# EAGLE design MgdOpl3 (EAGLE 9.5.0)
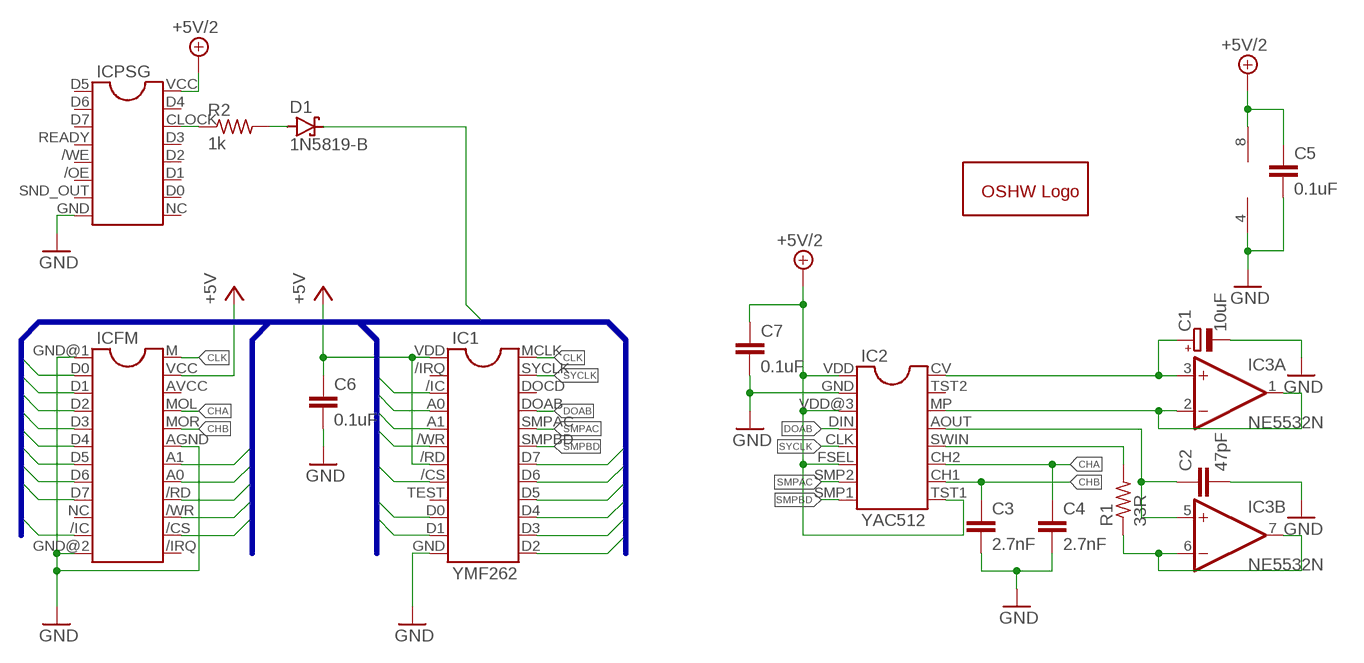
[diagram p0: schematic, sheet 1]

## Parts
C1  10uF  CPOL-EUE2.5-5  [E2,5-5]
C2  47pF  C-EU025-024X044  [C025-024X044]
C3  2.7nF  C-EU025-024X044  [C025-024X044]
C4  2.7nF  C-EU025-024X044  [C025-024X044]
C5  0.1uF  C-EU025-024X044  [C025-024X044]
C6  0.1uF  C-EU025-024X044  [C025-024X044]
C7  0.1uF  C-EU025-024X044  [C025-024X044]
D1  1N5819-B  [DO41-7.6]
GOLD_ORB_SM2  OSHWLOGOLOGO8MM  [OSHW_8MM]
IC1  YMF262  [YMF262]
IC2  YAC512  [YAC512]
IC3  NE5532N  [DIL08]
ICFM  YM2612YM2612_NOSILK  [YM2612_NOSILK]
ICPSG  SN76489SN76489_NOSILK  [SN76489_NOSILK]
R1  33R  R-US_0204/7  [0204/7]
R2  1k  R-US_0204/7  [0204/7]

## Nets
+5V: C6.1 IC1./RD IC1.VDD ICFM.VCC
+5V/2: C5.1 C7.1 IC2.FSEL IC2.TST1 IC2.VDD IC2.VDD@3(VDD) IC3.8(P:V+) ICPSG.VCC
/CS: IC1./CS ICFM./CS
/IC: IC1./IC ICFM./IC
/RD: ICFM./RD
/WR: IC1./WR ICFM./WR
A0: IC1.A0 ICFM.A0
A1: IC1.A1 ICFM.A1
CHA: C4.1 IC2.CH2 ICFM.MOL
CHB: C3.1 IC2.CH1 ICFM.MOR
CLK: IC1.MCLK ICFM.M
D0: IC1.D0 ICFM.D0
D1: IC1.D1 ICFM.D1
D2: IC1.D2 ICFM.D2
D3: D1.C IC1.D3 ICFM.D3
D4: IC1.D4 ICFM.D4
D5: IC1.D5 ICFM.D5
D6: IC1.D6 ICFM.D6
D7: IC1.D7 ICFM.D7
DOAB: IC1.DOAB IC2.DIN
GND: C1.- C2.2 C3.2 C4.2 C5.2 C6.2 C7.2 IC1.GND IC2.GND IC3.4(P:V-) ICFM.AGND ICFM.GND@1(GND) ICFM.GND@2(GND) ICPSG.GND
N$1: C1.+ IC2.CV IC3.3(A:+IN)
N$2: IC2.MP IC3.1(A:OUT) IC3.2(A:-IN)
N$3: IC3.6(B:-IN) IC3.7(B:OUT) R1.1
N$4: C2.1 IC2.AOUT IC3.5(B:+IN)
N$6: D1.A R2.2
N$7: IC2.SWIN R1.2
N$9: ICPSG.CLOCK R2.1
SMPAC: IC1.SMPAC IC2.SMP2
SMPBD: IC1.SMPBD IC2.SMP1
SYCLK: IC1.SYCLK IC2.CLK
Unconnected: IC1./IRQ IC1.DOCD IC1.TEST IC2.TST2 ICFM./IRQ ICFM.AVCC ICFM.NC ICPSG./OE ICPSG./WE ICPSG.D0 ICPSG.D1 ICPSG.D2 ICPSG.D3 ICPSG.D4 ICPSG.D5 ICPSG.D6 ICPSG.D7 ICPSG.NC ICPSG.READY ICPSG.SND_OUT

## Buses
A[0..1],/CS,D[0..7],/IC,/RD,/WR

## Library data of the parts
C1 = rcl:CPOL-EU: POLARIZED CAPACITOR, European symbol; SPICEPREFIX: C
C2-C7 = rcl:C-EU: CAPACITOR, European symbol; SPICEPREFIX: C
D1 = diode:1N581*: 1.0A SCHOTTKY BARRIER RECTIFIER Source: http://www.diodes.com/datasheets/ds23001.pdf
GOLD_ORB_SM2 = oshw:OSHWLOGO: The OSHW logo for PCB layout
IC1 = yammy-ha:YMF262
IC2 = yammy-ha:YAC512
IC3 = linear:NE5532: AUDIO AMPLIFIER
ICFM = yammy-ha:YM2612: Dual In Line
ICPSG = retrosound:SN76489: Dual In Line / Socket
R1 R2 = rcl:R-US_: RESISTOR, American symbol; SPICEPREFIX: R

## Board
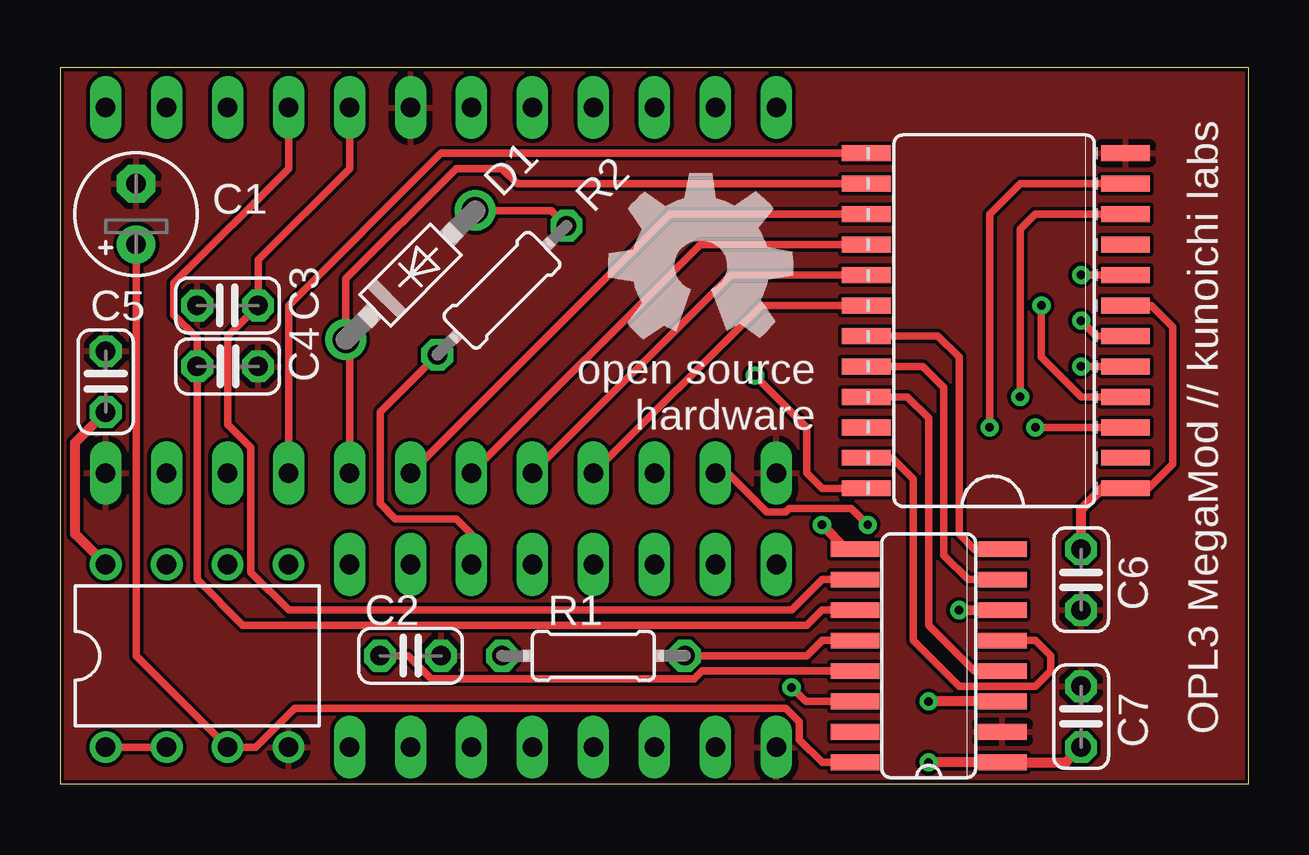
[diagram p1: board, top side]
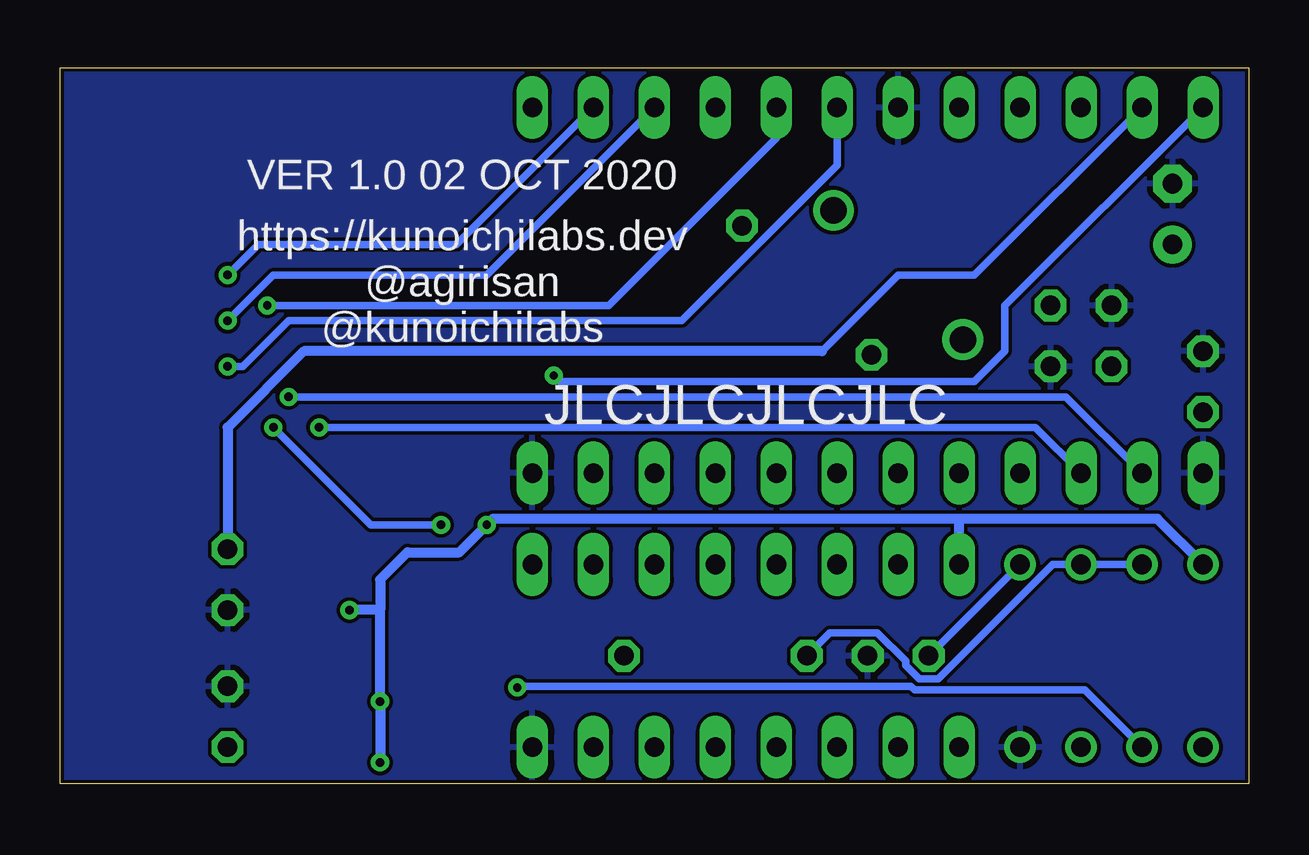
[diagram p2: board, bottom side, seen from below]

Size 49.53 x 29.84 mm. Coordinates in mm from the lower left corner, seen from the top.
Outline: 0,0 49.53,0 49.53,29.84 0,29.84 0,0
Copper layers (1*16): Top 0.035mm / dielectric 1.5mm / Bottom 0.035mm
Design rules "default *": minimum track width 6mil, minimum drill 0.35mm, track to track 6mil, track to pad 6mil, pad to pad 6mil, via to via 6mil, smd to smd 6mil, copper to edge 6mil, drill to drill 6mil, minimum pad ring 10mil, minimum via ring 8mil, stop-mask expansion 4mil, vias tented up to drill 20mil, thermal gap 10mil

### Footprints (pad centres in the part's own frame; a part is rotated, then mirrored left to right if it is on the bottom)
E2,5-5 = drill 0.813 pad 1.6: + -1.27,0 | drill 0.813 pad 1.6 octagon: - 1.27,0
C025-024X044 = drill 0.813 octagon: 1 -1.27,0; 2 1.27,0
DO41-7.6 = drill 1.1 pad 1.7: A 3.81,0; C -3.81,0
YMF262 = smd 0.66 x 2.032: /CS 1.905,-5.029; /IC -4.445,-5.029; /IRQ -5.715,-5.029; /RD 0.635,-5.029; /WR -0.635,-5.029; A0 -3.175,-5.029; A1 -1.905,-5.029; D0 4.445,-5.029; D1 5.715,-5.029; D2 6.985,5.78; D3 5.715,5.78; D4 4.445,5.78; D5 3.175,5.78; D6 1.905,5.78; D7 0.635,5.78; DOAB -3.175,5.78; DOCD -4.445,5.78; GND 6.985,-5.029; MCLK -6.985,5.78; SMPAC -1.905,5.78; SMPBD -0.635,5.78; SYCLK -5.715,5.78; TEST 3.175,-5.029; VDD -6.985,-5.029
YAC512 = smd 0.66 x 2.032: AOUT -0.635,3.073; CH1 3.175,3.073; CH2 1.905,3.073; CLK 0.635,-3.073; CV -4.445,3.073; DIN -0.635,-3.073; FSEL 1.905,-3.073; GND -3.175,-3.073; MP -1.905,3.073; SMP1 4.445,-3.073; SMP2 3.175,-3.073; SWIN 0.635,3.073; TST1 4.445,3.073; TST2 -3.175,3.073; VDD -4.445,-3.073; VDD@3 -1.905,-3.073
DIL08 = drill 0.813 pad 1.27: 1 -3.81,-3.81; 2 -1.27,-3.81; 3 1.27,-3.81; 4 3.81,-3.81; 5 3.81,3.81; 6 1.27,3.81; 7 -1.27,3.81; 8 -3.81,3.81
YM2612_NOSILK = drill 0.813 long: /CS 11.43,7.62; /IC 11.43,-7.62; /IRQ 13.97,7.62; /RD 6.35,7.62; /WR 8.89,7.62; A0 3.81,7.62; A1 1.27,7.62; AGND -1.27,7.62; AVCC -8.89,7.62; D0 -11.43,-7.62; D1 -8.89,-7.62; D2 -6.35,-7.62; D3 -3.81,-7.62; D4 -1.27,-7.62; D5 1.27,-7.62; D6 3.81,-7.62; D7 6.35,-7.62; GND@1 -13.97,-7.62; GND@2 13.97,-7.62; M -13.97,7.62; MOL -6.35,7.62; MOR -3.81,7.62; NC 8.89,-7.62; VCC -11.43,7.62
SN76489_NOSILK = drill 0.813 long: /OE 8.89,-3.81; /WE 6.35,-3.81; CLOCK 1.27,3.81; D0 11.43,3.81; D1 8.89,3.81; D2 6.35,3.81; D3 3.81,3.81; D4 -1.27,3.81; D5 -3.81,-3.81; D6 -1.27,-3.81; D7 1.27,-3.81; GND 13.97,-3.81; NC 13.97,3.81; READY 3.81,-3.81; SND_OUT 11.43,-3.81; VCC -3.81,3.81
0204/7 = drill 0.813 octagon: 1 -3.81,0; 2 3.81,0

### Placement (x,y rotation side)
C1  3.17,23.75 90 top
C2  14.61,5.33 0 top
C3  6.99,19.94 180 top
C4  6.99,17.4 0 top
C5  1.91,16.76 90 top
C6  42.55,8.51 270 top
C7  42.55,2.79 90 top
D1  14.61,21.21 45 top
GOLD_ORB_SM2  26.67,21.59 0 top
IC1  39.37,19.3 90 top
IC2  36.2,5.33 90 top
IC3  5.71,5.33 0 top
ICFM  15.88,20.57 0 top
ICPSG  15.88,5.33 0 top
R1  22.23,5.33 0 top
R2  18.41,20.57 45 top

### Tracks (layer width: path | path; a pad name or v marks a point on that pad's centre or on a via)
+5V
  Top 0.305: IC1./RD 45.47,19.94 46.35,19.05 46.35,13.34 45.34,12.32 IC1.VDD
  Top 0.406: IC1.VDD 43.43,12.32 42.55,11.43 C6.1
  Bottom 0.305: ICFM.VCC 11.43,21.21 14.61,21.21 17.78,18.03
  Bottom 0.406: 17.78,18.03 39.37,18.03 42.55,14.86 C6.1
+5V/2  (via drill 0.35)
  Top 0.406: IC3.8 0.64,10.41 0.64,14.22 C5.1 | v36.2,0.89 IC2.VDD 41.91,0.89 C7.1 | IC2.VDD@3 v36.2,3.43 | v37.47,7.24 IC2.FSEL | IC2.TST1 32.77,9.78 v31.75,10.79
  Bottom 0.406: IC3.8 3.81,11.05 12.06,11.05 | ICPSG.VCC 12.06,11.05 | 36.2,7.24 v36.2,3.43 v36.2,0.89 | 36.2,7.24 v37.47,7.24 | 36.2,7.24 36.2,8.51 35.05,9.65 32.89,9.65 v31.75,10.79 31.5,11.05 12.06,11.05
/CS  (via drill 0.35)
  Top 0.305: IC1./CS v42.55,21.21
  Bottom 0.305: ICFM./CS 33.02,22.48 41.27,22.48 v42.55,21.21
/IC  (via drill 0.35)
  Top 0.305: v40.64,14.86 IC1./IC | ICFM./IC 27.82,12.95 29.45,11.33 30.25,11.33 30.39,11.48 32.97,11.48 v33.66,10.79
  Bottom 0.305: v33.66,10.79 36.58,10.79 v40.64,14.86
/WR  (via drill 0.35)
  Top 0.305: IC1./WR 43.18,18.67 v42.55,19.3
  Bottom 0.305: ICFM./WR 31.75,21.21 40.64,21.21 v42.55,19.3
A0  (via drill 0.35)
  Top 0.305: IC1.A0 42.55,16.13 40.89,17.78 v40.89,19.94
  Bottom 0.305: ICFM.A0 19.68,26.92 26.67,19.94 v40.89,19.94
A1  (via drill 0.35)
  Top 0.305: IC1.A1 v42.55,17.4
  Bottom 0.305: ICFM.A1 17.14,25.78 23.62,19.3 40.01,19.3 41.91,17.4 v42.55,17.4
CHA
  Top 0.305: IC2.CH2 31.75,7.24 31.11,6.6 7.62,6.6 5.71,8.51 C4.1 5.71,18.57 4.75,19.54 4.75,20.88 9.53,25.65 ICFM.MOL
CHB
  Top 0.305: IC2.CH1 31.75,8.51 30.48,7.24 9.53,7.24 7.95,8.81 7.95,14.01 6.99,14.98 6.99,18.67 C3.1 8.26,21.84 12.06,25.65 ICFM.MOR
CLK  (via drill 0.35)
  Top 0.305: v28.96,17.02 31.11,14.86 31.11,12.95 31.75,12.32 IC1.MCLK
  Bottom 0.305: ICFM.M 10.16,19.94 10.16,18.03 11.43,16.76 28.7,16.76 v28.96,17.02
D0  (via drill 0.35)
  Top 0.305: v40.01,16.13 40.01,23.11 40.64,23.75 IC1.D0
  Bottom 0.305: ICFM.D0 7.62,16.13 v40.01,16.13
D1  (via drill 0.35)
  Top 0.305: v38.73,14.86 38.73,23.75 40.01,25.02 IC1.D1
  Bottom 0.305: ICFM.D1 8.89,14.86 v38.73,14.86
D2
  Top 0.305: ICFM.D2 9.53,19.94 15.75,26.16 15.88,26.29 IC1.D2
D3
  Top 0.305: 11.91,18.67 11.91,21.05 16.51,25.65 18.41,25.65 19.05,25.02 IC1.D3 | 11.91,18.67 D1.C | ICFM.D3 12.06,18.52 11.91,18.67
D4
  Top 0.305: ICFM.D4 25.4,23.75 IC1.D4
D5
  Top 0.305: IC1.D5 26.67,22.48 ICFM.D5
D6
  Top 0.305: ICFM.D6 27.94,21.21 IC1.D6
D7
  Top 0.305: IC1.D7 29.21,19.94 ICFM.D7
DOAB
  Top 0.305: IC2.DIN 38.1,4.7 36.2,6.6 36.2,15.24 35.31,16.13 IC1.DOAB
GND
  pour Top: -0.64,30.1 50.16,30.1 50.16,-0.38 -0.64,-0.38
  pour Bottom: -0.64,30.1 50.16,30.1 50.16,-0.38 -0.64,-0.38
N$1
  Top 0.305: IC2.CV 31.75,0.89 30.81,1.83 30.81,2.58 30.25,3.15 9.79,3.15 8.16,1.52 IC3.3 3.17,5.33 C1.+
N$2  (via drill 0.35)
  Top 0.305: v30.48,4.02 31.07,3.43 IC2.MP | IC3.2 IC3.1
  Bottom 0.305: IC3.2 6.83,3.91 13.92,3.91 14.08,4.06 30.48,4.06 v30.48,4.02
N$3
  Bottom 0.305: IC3.7 IC3.6 8.16,9.14 12.94,4.37 13.73,4.37 14.3,4.93 14.3,5.12 15.47,6.3 17.45,6.3 R1.1
N$4
  Top 0.305: C2.1 14.51,5.33 15.47,4.37 26.43,4.37 26.77,4.7 IC2.AOUT
  Bottom 0.305: IC3.5 C2.1
N$6
  Top 0.305: D1.A 20.47,23.9 R2.2
N$7
  Top 0.305: R1.2 31.11,5.33 31.75,5.97 IC2.SWIN
N$9
  Top 0.305: ICPSG.CLOCK 17.14,10.41 16.51,11.05 13.97,11.05 13.34,11.68 13.34,15.24 13.34,15.49 | 13.34,15.49 | 13.34,15.49 R2.1
SMPAC
  Top 0.305: IC2.SMP2 37.85,8.51 36.83,9.53 36.83,16.51 35.94,17.4 IC1.SMPAC
SMPBD
  Top 0.305: IC2.SMP1 38.1,9.78 37.47,10.41 37.47,17.78 36.58,18.67 IC1.SMPBD
SYCLK
  Top 0.305: IC2.CLK 40.64,5.97 41.27,5.33 41.27,4.7 40.64,4.06 37.47,4.06 35.56,5.97 35.56,12.7 34.67,13.59 IC1.SYCLK

### Text on the board
tNames: OPL3 MegaMod // kunoichi labs
bNames: VER 1.0 02 OCT 2020 | https://kunoichilabs.dev / @agirisan / @kunoichilabs | JLCJLCJLCJLC